# Altium project BAJASENSORS.PrjPcb
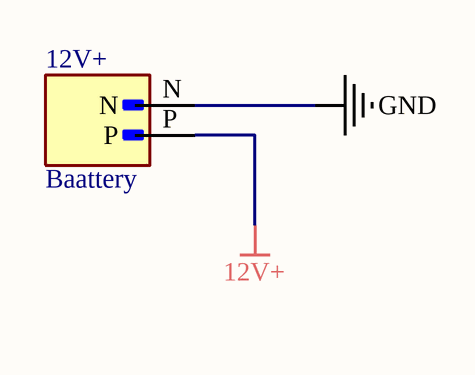
[diagram p0: Batteries.SchDoc]
5 sheets, 9 parts. Net scope: flat (ports and power ports of the same name join across sheets).
Board file: PCB.PcbDoc
Sheets:
  Batteries.SchDoc
  EngineLines.SchDoc
  Pico.SchDoc
  IMU.SchDoc
  SD_Card.SchDoc

## Sheet Batteries.SchDoc
size A; SheetNumber: 1; SheetTotal: 5; SPICEModelCacheOUMKRGKS: <root> / <DocumentId>OUMKRGKS</DocumentId> / </root>

### Parts
12V+  Baattery  [AMASS_XT30UPB-M]

### Nets
12V+: 12V+.P
GND: 12V+.N

### Library data of the parts
12V+ = XT30UPB-M: Socket; DC supply; XT30; male; PIN: 2; on PCBs; THT; yellow; 15A; 500V; MF: amass; SnapEDA_Link: https://www.snapeda.com/parts/XT30UPB-M/AMASS/view-part/?ref=snap; Package: None; Value: *; MP: XT30UPB-M; Check_prices: https://www.snapeda.com/parts/XT30UPB-M/AMASS/view-part/?ref=eda

## Sheet EngineLines.SchDoc
size A; SheetNumber: 3; SheetTotal: 10
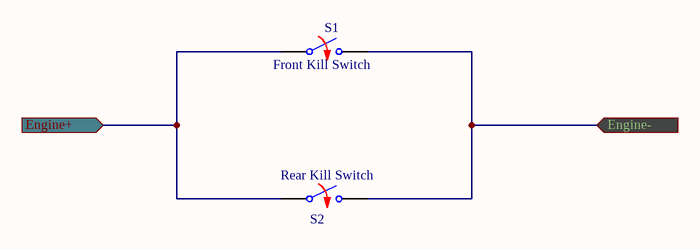
[diagram p1: EngineLines.SchDoc]

### Parts
S1  Front Kill Switch
S2  Rear Kill Switch

### Ports
Engine+ (in), Engine- (in)

### Nets
NetS1_1: S1.1 S2.1 ; port Engine+
NetS1_2: S1.2 S2.2 ; port Engine-

### Library data of the parts
S1 S2 = SW NO: Switch Normally Opened; closed: 0; Rclosed: 1m; Ropen: 1Meg; SimulationGenericComponent: True

## Sheet Pico.SchDoc
size A; SheetNumber: 3; SheetTotal: 5
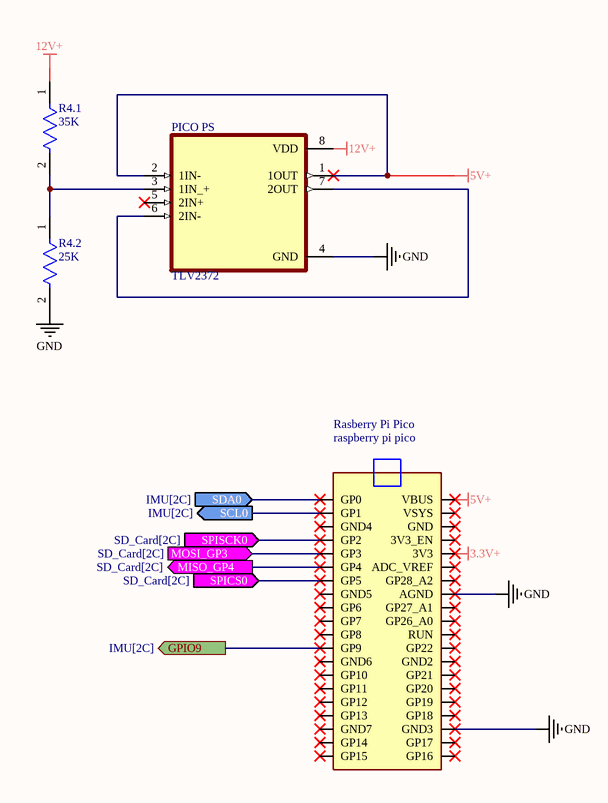
[diagram p2: Pico.SchDoc]

### Parts
PICO_PS  TLV2372  [DIP794W45P254L959H508Q8]
R4.1  35K  [FP-MFR-12-MFG]
R4.2  25K  [FP-MFR-12-MFG]
Rasberry_Pi_Pico  (no value)  [RASPBERRY_PI_PICO]

### Ports
GPIO9 (out, see IMU[2C]), MISO_GP4 (out, see SD_Card[2C]), MOSI_GP3 (in, see SD_Card[2C]), SCL0 (out, see IMU[2C]), SDA0 (in, see IMU[2C]), SPICS0 (in, see SD_Card[2C]), SPISCK0 (in, see SD_Card[2C])

### Nets
3.3V+: Rasberry_Pi_Pico.3V3
5V+: PICO_PS.1(1OUT) PICO_PS.2(1IN-) Rasberry_Pi_Pico.VBUS
12V+: PICO_PS.8(VDD) R4.1.1
GND: PICO_PS.4(GND) R4.2.2 Rasberry_Pi_Pico.AGND Rasberry_Pi_Pico.GND3
NetIMU_1: Rasberry_Pi_Pico.GP9 ; port GPIO9
NetIMU_2: Rasberry_Pi_Pico.GP0 ; port SDA0
NetIMU_3: Rasberry_Pi_Pico.GP1 ; port SCL0
NetPICO_PS_3: PICO_PS.3(1IN_+) R4.1.2 R4.2.1
NetPICO_PS_6: PICO_PS.6(2IN-) PICO_PS.7(2OUT)
NetRasberry_Pi_Pico_GP2: Rasberry_Pi_Pico.GP2 ; port SPISCK0
NetRasberry_Pi_Pico_GP3: Rasberry_Pi_Pico.GP3 ; port MOSI_GP3
NetRasberry_Pi_Pico_GP4: Rasberry_Pi_Pico.GP4 ; port MISO_GP4
NetRasberry_Pi_Pico_GP5: Rasberry_Pi_Pico.GP5 ; port SPICS0

Not connected (* = marked no-connect by the designer): PICO_PS 5(2IN+)*; Rasberry_Pi_Pico 3V3_EN* ADC_VREF* GND* GND2* GND4* GND5* GND6* GND7* GP6* GP7* GP8* GP10* GP11* GP12* GP13* GP14* GP15* GP16* GP17* GP18* GP19* GP20* GP21* GP22* GP26_A0* GP27_A1* GP28_A2* RUN* VSYS*

### Notes on the sheet
- (in symbol RASPBERRY_PI_PICO) raspberry pi pico

### Library data of the parts
PICO_PS = TLV2372IP: Dual, 16-V, 3-MHz, RRIO operational amplifier; MF: Texas Instruments; SnapEDA_Link: https://www.snapeda.com/parts/TLV2372IP/Texas+Instruments/view-part/?ref=snap; Package: PDIP-8 Texas; Value: *; MP: TLV2372IP; Check_prices: https://www.snapeda.com/parts/TLV2372IP/Texas+Instruments/view-part/?ref=eda
R4.1 R4.2 = CMP-03413-000012-1: RES MF 1/6W 1% AXIAL; Power Rating: 160mW; Voltage Rating (DC): 200V; Resistance: 10kR; Min Operating Temperature: -55°C; Max Operating Temperature: 155°C; Voltage Rating: 200V; Termination: Axial; Packaging: Ammo Pack; Tolerance: 1%
Rasberry_Pi_Pico = RASPBERRY_PI_PICO: Raspberry Pi Board, Arm Cortex-M0+; Core Architecture:Arm; Core Sub-Architecture:Cortex-M0+; Kit Contents:Raspberry Pi Pico Board; No. Of Bits:32Bit; Silicon Core Number:Rp2040; Silicon Manufacturer:Raspberry Pi |Raspberry-Pi RASPBERRY PI PICO; SnapEDA_Link: https://www.snapeda.com/parts/RASPBERRY%20PI%20PICO/Raspberry+Pi/view-part/?ref=snap; Package: None; Value: *; MF: Raspberry Pi; MP: RASPBERRY PI PICO; Check_prices: https://www.snapeda.com/parts/RASPBERRY%20PI%20PICO/Raspberry+Pi/view-part/?ref=eda

## Sheet IMU.SchDoc
size A; SheetNumber: 4; SheetTotal: 5
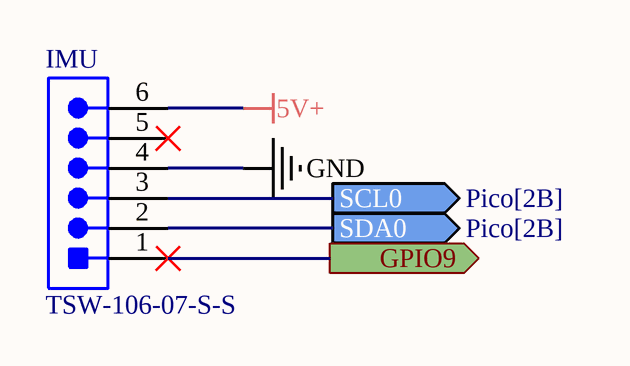
[diagram p3: IMU.SchDoc]

### Parts
IMU  TSW-106-07-S-S  [SMTC-TSW-106-07-S-S_V]

### Ports
GPIO9 (out), SCL0 (out, see Pico[2B]), SDA0 (out, see Pico[2B])

### Nets
5V+: IMU.6
GND: IMU.4
NetIMU_1: IMU.1 ; port GPIO9
NetIMU_2: IMU.2 ; port SDA0
NetIMU_3: IMU.3 ; port SCL0

Not connected (* = marked no-connect by the designer): IMU 5*

### Library data of the parts
IMU = CMP-1681-00007-2: Male Header, Pitch 2.54 mm, 1 x 6 Position, Height 8.38 mm, Tail Length 2.54 mm, -55 to 125 degC, RoHS, Bulk; Manufacturer: Samtec; Rows: 1; Contact Finish: Gold; Lead Pitch: 0.1 inch; Package Quantity: 1; Mounting Technology: Through Hole; ComponentLink1Description: Manufacturer URL; Contact Plating: Gold; DatasheetVersion: 12/2015; ComponentLink3Description: Package Specification; PackageDescription: Male Header, Pitch 2.54 mm, 1 x 6 Position, Height 8.38 mm, Tail Length 2.54 mm; Height: 8.38 mm; ComponentLink2Description: Datasheet; RoHSCompliant: true; Colour: Black; Packaging: Bulk; Min Operating Temperature: -55 degC; ComponentLink2URL: http://suddendocs.samtec.com/catalog_english/tsw_th.pdf; Mount: Through Hole; PackageReference: TSW-102-07-S-S; Pins: 6; Max Operating Temperature: 125 degC; ComponentLink3URL: http://suddendocs.samtec.com/prints/tsw-xxx-xx-x-x-xx-xxx-footprint.pdf; Length: 15.24 mm; Contact Material: Bronze; ComponentLink1URL: http://www.samtec.com/

## Sheet SD_Card.SchDoc
size A; SheetNumber: 10; SheetTotal: 10
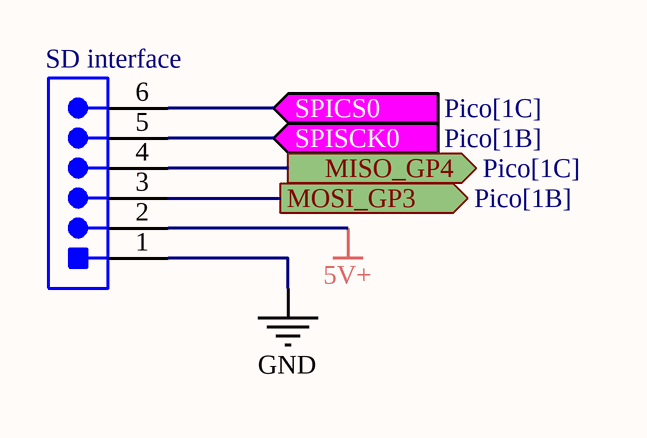
[diagram p4: SD_Card.SchDoc]

### Parts
SD_interface  SD Card  [SMTC-TSW-106-07-S-S_V]  (value not drawn)

### Ports
MISO_GP4 (out, see Pico[1C]), MOSI_GP3 (out, see Pico[1B]), SPICS0 (in, see Pico[1C]), SPISCK0 (in, see Pico[1B])

### Nets
5V+: SD_interface.2
GND: SD_interface.1
NetRasberry_Pi_Pico_GP2: SD_interface.5 ; port SPISCK0
NetRasberry_Pi_Pico_GP3: SD_interface.3 ; port MOSI_GP3
NetRasberry_Pi_Pico_GP4: SD_interface.4 ; port MISO_GP4
NetRasberry_Pi_Pico_GP5: SD_interface.6 ; port SPICS0

### Library data of the parts
SD_interface = CMP-1681-00007-2: as IMU on sheet IMU; Contact Finish: Gold; Lead Pitch: 0.1 inch; Package Quantity: 1; Mounting Technology: Through Hole; ComponentLink1Description: Manufacturer URL; Contact Plating: Gold; DatasheetVersion: 12/2015; ComponentLink3Description: Package Specification; PackageDescription: Male Header, Pitch 2.54 mm, 1 x 6 Position, Height 8.38 mm, Tail Length 2.54 mm; Height: 8.38 mm; ComponentLink2Description: Datasheet; RoHSCompliant: true; Colour: Black; Packaging: Bulk; Min Operating Temperature: -55 degC; ComponentLink2URL: http://suddendocs.samtec.com/catalog_english/tsw_th.pdf; Mount: Through Hole; PackageReference: TSW-102-07-S-S; Pins: 6; Max Operating Temperature: 125 degC; ComponentLink3URL: http://suddendocs.samtec.com/prints/tsw-xxx-xx-x-x-xx-xxx-footprint.pdf; Length: 15.24 mm; Contact Material: Bronze; ComponentLink1URL: http://www.samtec.com/

## Nets that join several sheets
5V+: Pico (PICO_PS.1 PICO_PS.2 Rasberry_Pi_Pico.VBUS), IMU (IMU.6), SD_Card (SD_interface.2)
12V+: Batteries (12V+.P), Pico (PICO_PS.8 R4.1.1)
GND: Batteries (12V+.N), Pico (PICO_PS.4 R4.2.2 Rasberry_Pi_Pico.AGND Rasberry_Pi_Pico.GND3), IMU (IMU.4), SD_Card (SD_interface.1)
NetIMU_1: Pico (Rasberry_Pi_Pico.GP9), IMU (IMU.1)
NetIMU_2: Pico (Rasberry_Pi_Pico.GP0), IMU (IMU.2)
NetIMU_3: Pico (Rasberry_Pi_Pico.GP1), IMU (IMU.3)
NetRasberry_Pi_Pico_GP2: Pico (Rasberry_Pi_Pico.GP2), SD_Card (SD_interface.5)
NetRasberry_Pi_Pico_GP3: Pico (Rasberry_Pi_Pico.GP3), SD_Card (SD_interface.3)
NetRasberry_Pi_Pico_GP4: Pico (Rasberry_Pi_Pico.GP4), SD_Card (SD_interface.4)
NetRasberry_Pi_Pico_GP5: Pico (Rasberry_Pi_Pico.GP5), SD_Card (SD_interface.6)